# Altium schematic sheet Power_BZ_LED_HD.SchDoc
size A3; SheetNumber: 3; SheetTotal: 3
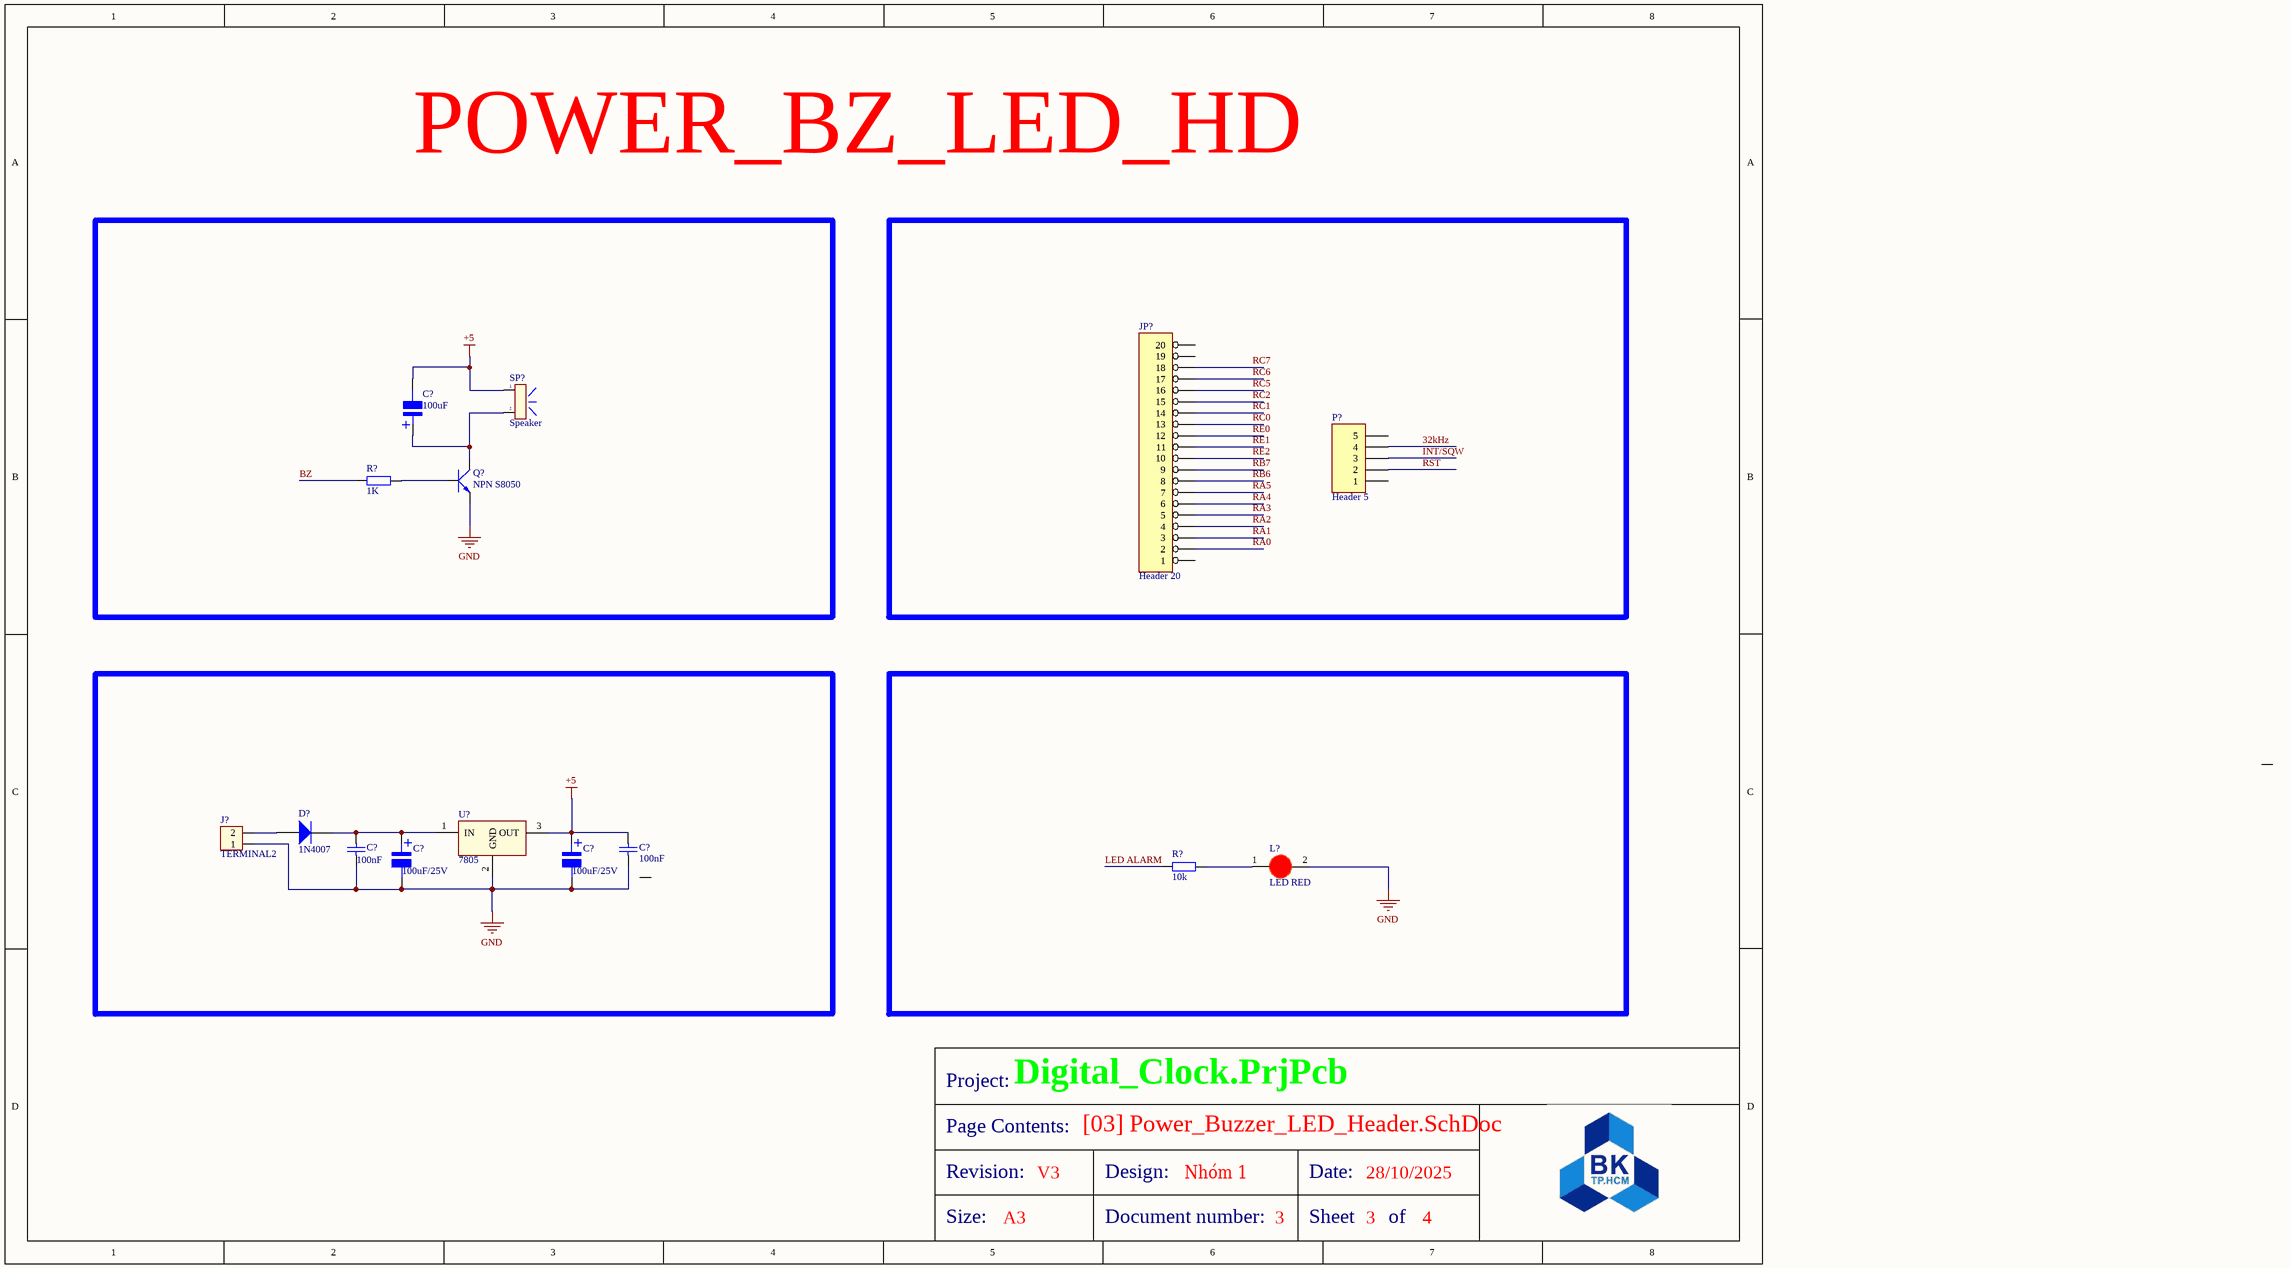
[diagram p0: Power_BZ_LED_HD.SchDoc]

## Parts
(Parts that share a designator on the sheet are numbered #1, #2 ... from top to bottom, then left to right.)
C?#1  100uF  [tu nhom 10 (g)]
C?#2  100nF  [tu gom]
C?#3  100nF  [tu gom]
C?#4  100uF/25V  [tu nhom 10 (g)]
C?#5  100uF/25V  [tu nhom 10 (g)]
D?  1N4007  [DIODE SOD-123]
J?  TERMINAL2  [Header 2P DC 2.54]
JP?  Header 20
L?  LED RED  [LED-5MM-RED]
P?  Header 5
Q?  NPN S8050  [QTO-92]
R?#1  1K  [tro smd 0603]
R?#2  10k  [tro smd 0603]
SP?  Speaker  [SPK]
U?  7805  [QTO-220]

## Nets
+5: C?#1.2 C?#3.1 C?#5.1 SP?.1 U?.3(OUT)
GND: C?#2.2 C?#3.2 C?#4.2 C?#5.2 J?.1 L?.2(K) Q?.1(E) U?.2(GND)
32kHz: P?.4
BZ: R?#1.1
INT/SQW: P?.3
LED ALARM: R?#2.1
RA0: JP?.2
RA1: JP?.3
RA2: JP?.4
RA3: JP?.5
RA4: JP?.6
RA5: JP?.7
RB6: JP?.8
RB7: JP?.9
RC0: JP?.13
RC1: JP?.14
RC2: JP?.15
RC5: JP?.16
RC6: JP?.17
RC7: JP?.18
RE0: JP?.12
RE1: JP?.11
RE2: JP?.10
RST: P?.2
NetC?#1_1: C?#1.1 Q?.2(C) SP?.2
NetC?#2_1: C?#2.1 C?#4.1 D?.2(K) U?.1(IN)
NetD?_1: D?.1(A) J?.2
NetL?_1: L?.1(A) R?#2.2
NetQ?_3: Q?.3(B) R?#1.2

Not connected (* = marked no-connect by the designer): JP? 1 19 20; P? 1 5

## Notes on the sheet
- POWER_BZ_LED_HD
- Project:
- Digital_Clock.PrjPcb
- Page Contents:
- [03] Power_Buzzer_LED_Header.SchDoc
- Revision:
- Size:
- A3
- V3
- Design:
- Document number:
- Nhóm 1
- 3
- Date:
- Sheet
- 28/10/2025
- of
- 4
- (in symbol Tu Nhom 100uF 35V) +

## Library data of the parts
C?#1 C?#4 C?#5 = Tu Nhom 100uF 35V: Dán; Don_Vi: Con; Ten_Linh_Kien: Tụ Nhôm 100uF 35V; Ma_Hang: MH004019; So_Chan: 2; Chung_Loai: Dán; Kieu_Chan: *
C?#2 C?#3 = Tu gom 22pF 50V: Cắm; Don_Vi: Con; So_Chan: 2; Ten_Linh_Kien: Tụ gốm 22P 50V; Ma_Hang: MH004771; Chung_Loai: Cắm; Kieu_Chan: *
D? = Diode S4: Dán; Ten_Linh_Kien: Diode S4 SOD123 ( 1N5819 SOD123); Ma_Hang: MH005519; Don_Vi: Con; Ghi_Chu: *; Chung_Loai: Dán; Kieu_Chan: *
J? = Header 2P 2.54 Duc Cong: Cắm; Ten_Linh_Kien: Header 2P XH2.54-2P Đực Cong; Don_Vi: Con; Ma_Hang: MH002852; Chung_Loai: Cắm
JP? = Header 20: Header, 20-Pin, Right Angle
L? = LED 5mm Do: Cắm; Don_Vi: Con; Ma_Hang: MH008967; Ten_Linh_Kien: Led 5MM Phủ Đỏ (1000c); Ghi_Chu: *; Kieu_Chan: *; Chung_Loai: Cắm
P? = Header 5: Header, 5-Pin; LatestRevisionDate: 17-Jul-2002; LatestRevisionNote: Re-released for DXP Platform.; Publisher: Altium Limited
Q? = NPN_ECB: P 600mW, ECB; Value: C1815
R?#1 R?#2 = Tro 0603 5% 10k: Dán; Don_Vi: Con; So_Chan: 2; Ten_Linh_Kien: Trở 0603 5% 10k; Ma_Hang: MH006316; Chung_Loai: Dán; Kieu_Chan: *
SP? = SPK: Speaker Chip; Value: Speaker Chip
U? = LM78xx: On ap +, from + 5 to + 24VDC; Value: LM7805